# Altium schematic sheet Test Points.SchDoc
size A3; SheetNumber: 11; SheetTotal: 15
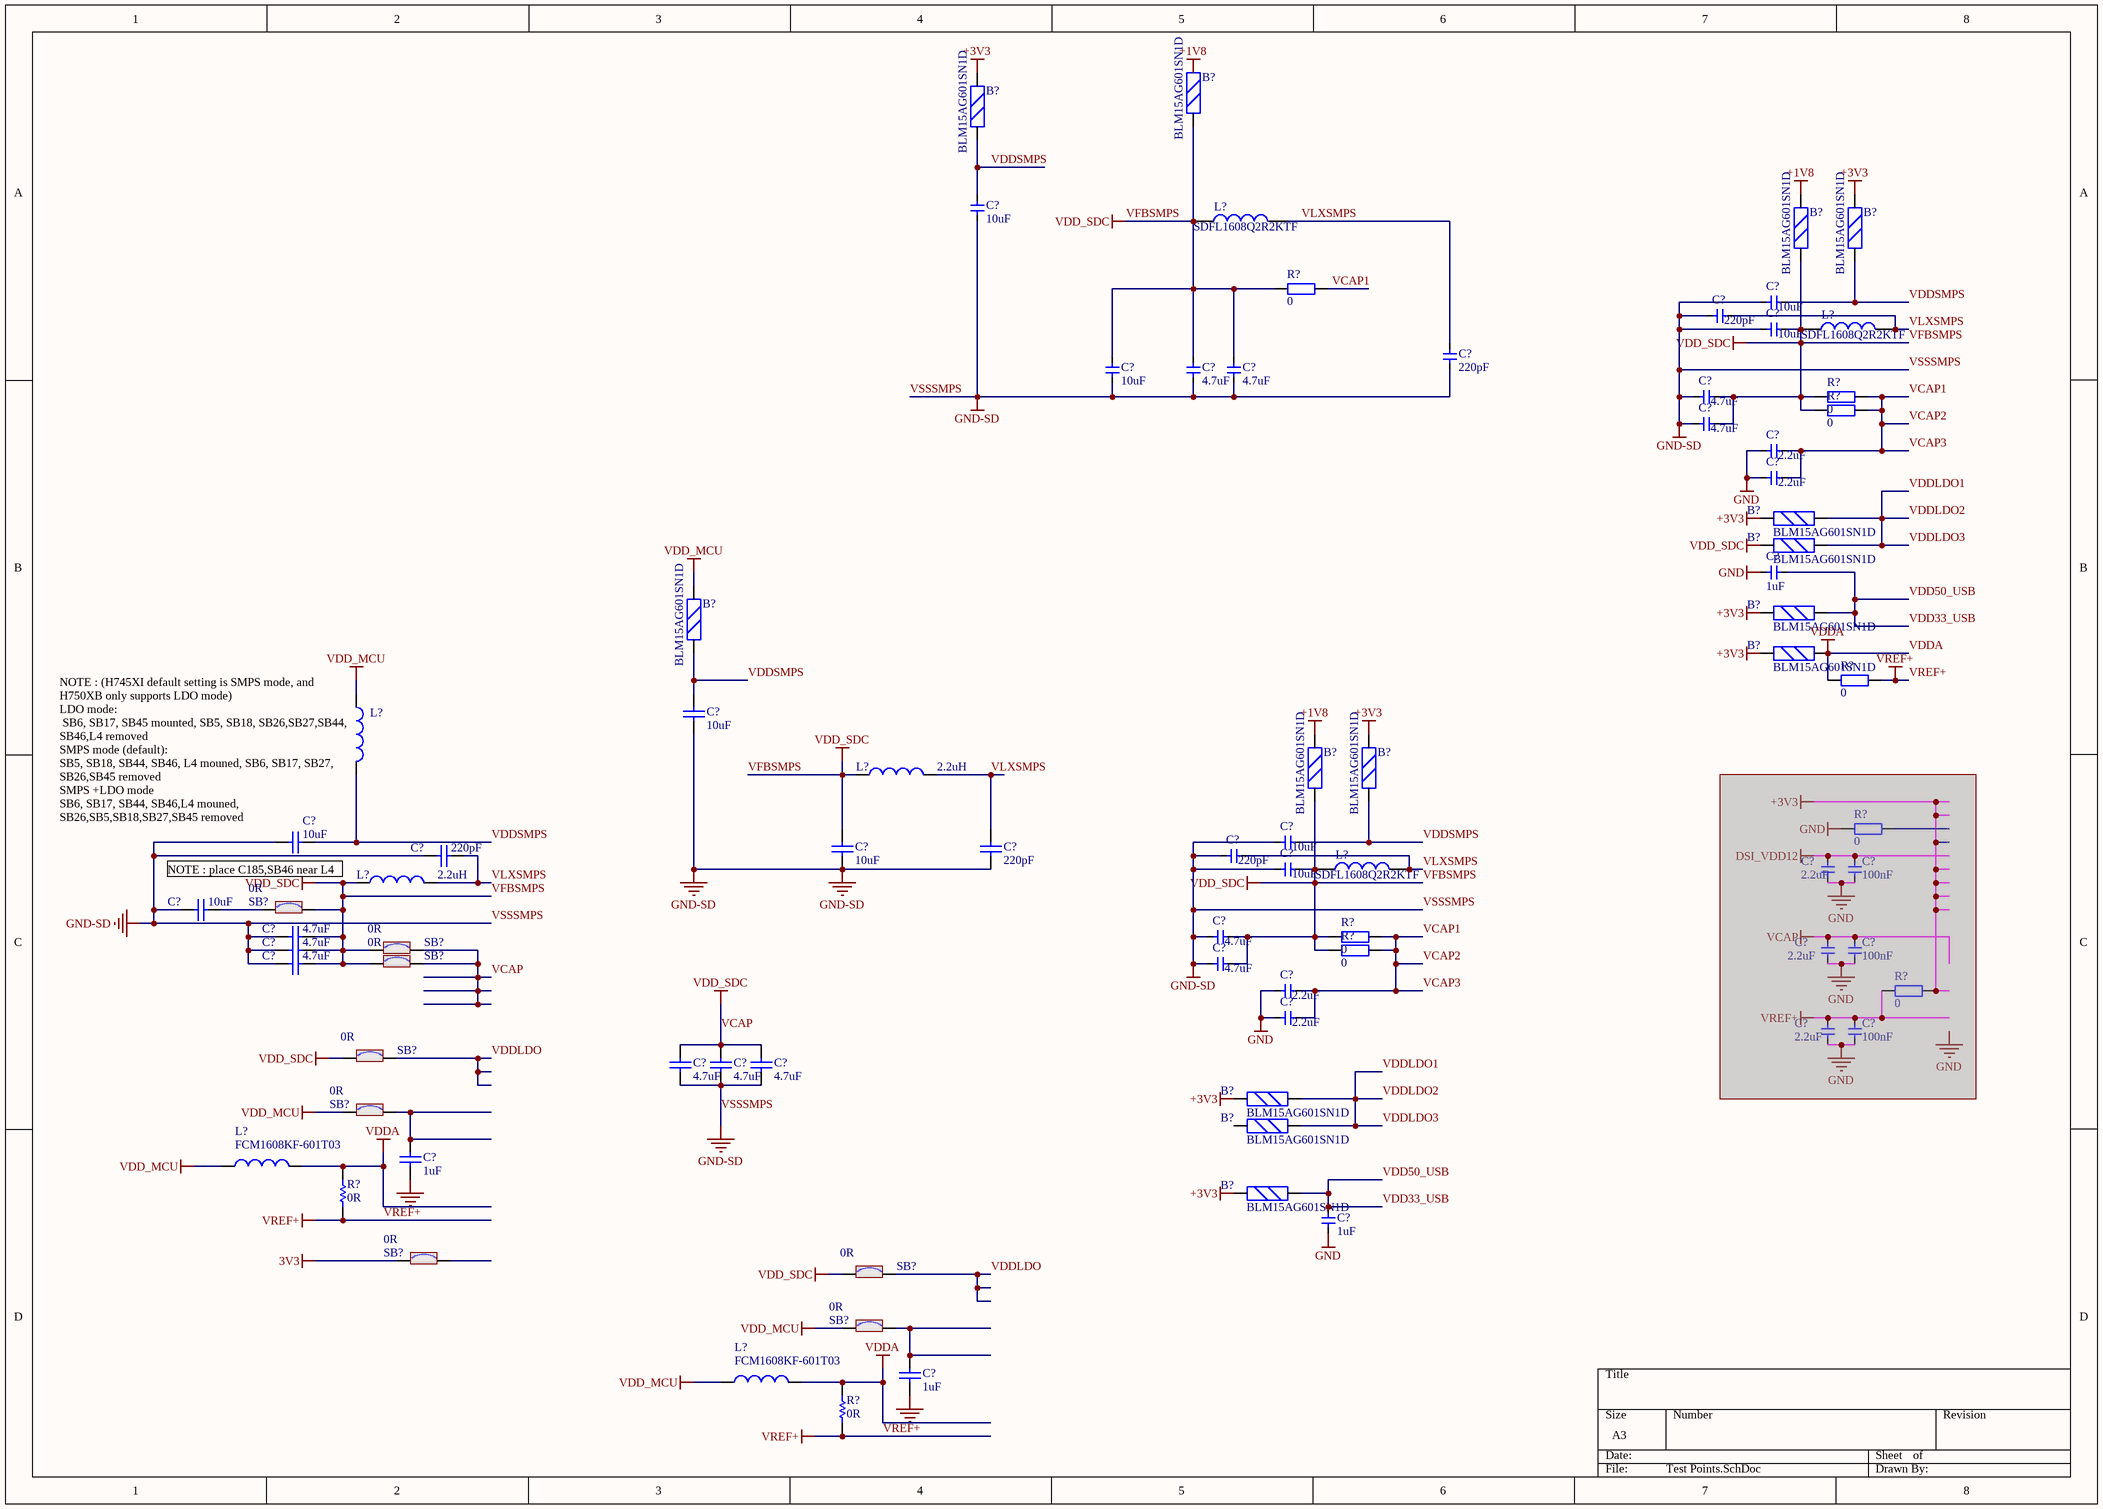
[diagram p0: Test Points.SchDoc]

## Parts
(Parts that share a designator on the sheet are numbered #1, #2 ... from top to bottom, then left to right.)
B?#1  BLM15AG601SN1D  [L0603]
B?#2  BLM15AG601SN1D  [L0603]
B?#3  BLM15AG601SN1D  [L0603]
B?#4  BLM15AG601SN1D  [L0603]
B?#5  BLM15AG601SN1D  [L0603]
B?#6  BLM15AG601SN1D  [L0603]
B?#7  BLM15AG601SN1D  [L0603]
B?#8  BLM15AG601SN1D  [L0603]
B?#9  BLM15AG601SN1D  [L0603]
B?#10  BLM15AG601SN1D  [L0603]
B?#11  BLM15AG601SN1D  [L0603]
B?#12  BLM15AG601SN1D  [L0603]
B?#13  BLM15AG601SN1D  [L0603]
B?#14  BLM15AG601SN1D  [L0603]
C?#1  10uF  [0402_CAP]
C?#2  10uF  [0402_CAP]
C?#3  220pF  [0402_CAP]
C?#4  10uF  [0402_CAP]
C?#5  220pF  [0402_CAP]
C?#6  10uF  [0402_CAP]
C?#7  4.7uF  [0402_CAP]
C?#8  4.7uF  [0402_CAP]
C?#9  4.7uF  [0402_CAP]
C?#10  4.7uF  [0402_CAP]
C?#11  2.2uF  [0402_CAP]
C?#12  2.2uF  [0402_CAP]
C?#13  1uF  [0402_CAP]
C?#14  value 10uF  [C0402]  (hidden comment: Capacitor)
C?#15  value 10uF  [C0402]  (hidden comment: Capacitor)
C?#16  value 220pF  [C0402]  (hidden comment: Capacitor)
C?#17  10uF  [0402_CAP]
C?#18  value 10uF  [C0603]  (hidden comment: Capacitor)
C?#19  value 220pF  [C0402]  (hidden comment: Capacitor)
C?#20  220pF  [0402_CAP]
C?#21  10uF  [0402_CAP]
C?#22  2.2uF  [0402_CAP]  (masked out: inside a compile mask, not in the netlist)
C?#23  100nF  [0402_CAP]  (masked out: inside a compile mask, not in the netlist)
C?#24  value 10uF  [C0603]  (hidden comment: Capacitor)
C?#25  4.7uF  [0402_CAP]
C?#26  value 4.7uF  [C0402]  (hidden comment: Capacitor)
C?#27  2.2uF  [0402_CAP]  (masked out: inside a compile mask, not in the netlist)
C?#28  100nF  [0402_CAP]  (masked out: inside a compile mask, not in the netlist)
C?#29  value 4.7uF  [C0402]  (hidden comment: Capacitor)
C?#30  4.7uF  [0402_CAP]
C?#31  value 4.7uF  [C0402]  (hidden comment: Capacitor)
C?#32  2.2uF  [0402_CAP]
C?#33  2.2uF  [0402_CAP]
C?#34  2.2uF  [0402_CAP]  (masked out: inside a compile mask, not in the netlist)
C?#35  100nF  [0402_CAP]  (masked out: inside a compile mask, not in the netlist)
C?#36  value 4.7uF  [C0402]  (hidden comment: Capacitor)
C?#37  value 4.7uF  [C0402]  (hidden comment: Capacitor)
C?#38  value 4.7uF  [C0402]  (hidden comment: Capacitor)
C?#39  value 1uF  [C0603]  (hidden comment: Capacitor)
C?#40  1uF  [0402_CAP]
C?#41  value 1uF  [C0603]  (hidden comment: Capacitor)
L?#1  SDFL1608Q2R2KTF  [L0805]
L?#2  SDFL1608Q2R2KTF  [L0805]
L?#3  Inductor  [IND_TAIYO-YUDEN_FBMJ1608]  (value not drawn)
L?#4  value 2.2uH  [IND_2016_MURATA_LQM2MPN2R2NG0]
L?#5  value 2.2uH  [IND_2016_MURATA_LQM2MPN2R2NG0]
L?#6  SDFL1608Q2R2KTF  [L0805]
L?#7  Manufacturer_Part_Number: FCM1608KF-601T03  [L0603]  (hidden comment: BEAD)
L?#8  Manufacturer_Part_Number: FCM1608KF-601T03  [L0603]  (hidden comment: BEAD)
R?#1  0  [0402_RES]
R?#2  0  [0402_RES]
R?#3  0  [0402_RES]
R?#4  0  [0402_RES]
R?#5  0  [0402_RES]  (masked out: inside a compile mask, not in the netlist)
R?#6  0  [0402_RES]
R?#7  0  [0402_RES]
R?#8  0  [0402_RES]  (masked out: inside a compile mask, not in the netlist)
R?#9  value 0R  [R0603]  (hidden comment: Resistor)
R?#10  value 0R  [R0603]  (hidden comment: Resistor)
SB?#1  value 0R  [SOLDER-BRIDGE_R0603-0R]  (hidden comment: SB_ON)
SB?#2  value 0R  [SOLDER-BRIDGE_R0603-0R]  (hidden comment: SB_ON)
SB?#3  value 0R  [SOLDER-BRIDGE_R0603-0R]  (hidden comment: SB_ON)
SB?#4  value 0R  [SOLDER-BRIDGE_R0603-0R]  (hidden comment: SB_ON)
SB?#5  value 0R  [SOLDER-BRIDGE_R0603-0R]  (hidden comment: SB_ON)
SB?#6  value 0R  [SOLDER-BRIDGE_R0603-0R]  (hidden comment: SB_ON)
SB?#7  value 0R  [SOLDER-BRIDGE_R0603-0R]  (hidden comment: SB_ON)
SB?#8  value 0R  [SOLDER-BRIDGE_R0603-0R]  (hidden comment: SB_ON)

## Nets
3V3: SB?#6.1
+1V8: B?#3.2 B?#10.2
+3V3: B?#2.2 B?#4.2 B?#5.1 B?#7.1 B?#9.1 B?#11.2 B?#12.1 B?#14.1
GND: C?#11.1 C?#12.1 C?#13.1 C?#32.1 C?#33.1 C?#39.1 C?#40.1 C?#41.1
VCAP: B?#1.1 B?#3.1 B?#6.1 B?#10.1 C?#4.2 C?#6.2 C?#7.2 C?#8.2 C?#9.2 C?#10.2 C?#18.2 C?#21.2 C?#25.2 C?#26.1 C?#29.1 C?#30.2 C?#31.1 C?#36.1 C?#37.1 C?#38.1 L?#1.1 L?#2.1 L?#4.1 L?#5.1 L?#6.1 R?#1.1 R?#2.1 R?#3.1 R?#6.1 R?#7.1 SB?#1.2 SB?#2.1 SB?#2.2 SB?#3.1 SB?#3.2 SB?#4.1 SB?#7.1  [also labelled VDD_SDC, VFBSMPS]
VDD_MCU: B?#8.2 L?#3.1 L?#7.1 L?#8.1 SB?#5.1 SB?#8.1
VDDA: B?#9.2 L?#7.2 L?#8.2 R?#4.1 R?#9.1 R?#10.1
VREF+: R?#4.2 R?#9.2 R?#10.2
VSSSMPS: C?#1.1 C?#2.1 C?#3.1 C?#4.1 C?#5.1 C?#6.1 C?#7.1 C?#8.1 C?#9.1 C?#10.1 C?#14.1 C?#15.1 C?#16.1 C?#17.1 C?#18.1 C?#19.1 C?#20.1 C?#21.1 C?#24.1 C?#25.1 C?#26.2 C?#29.2 C?#30.1 C?#31.2 C?#36.2 C?#37.2 C?#38.2  [also labelled GND-SD]
VCAP1: C?#11.2 C?#12.2 C?#32.2 C?#33.2 R?#1.2 R?#2.2 R?#3.2 R?#6.2 R?#7.2  [also labelled VCAP2, VCAP3]
VDD33_USB: B?#7.2 B?#14.2 C?#13.2 C?#40.2  [also labelled VDD50_USB]
VDDLDO: SB?#4.2 SB?#7.2
VDDLDO1: B?#5.2 B?#6.2 B?#12.2 B?#13.2  [also labelled VDDLDO2, VDDLDO3]
VDDSMPS: B?#2.1 B?#4.1 B?#8.1 B?#11.1 C?#1.2 C?#2.2 C?#14.2 C?#15.2 C?#17.2 L?#3.2
VLXSMPS: C?#3.2 C?#5.2 C?#16.2 C?#19.2 C?#20.2 L?#1.2 L?#2.2 L?#4.2 L?#5.2 L?#6.2
NetC?#24_2: C?#24.2 SB?#1.1
NetC?#39_2: C?#39.2 SB?#5.2
NetC?#41_2: C?#41.2 SB?#8.2

Not connected (* = marked no-connect by the designer): B?#1 2; B?#13 1; SB?#6 2

## Notes on the sheet
- (near L?#3) NOTE : (H745XI default setting is SMPS mode, and H750XB only supports LDO mode)
  LDO mode:
  SB6, SB17, SB45 mounted, SB5, SB18, SB26,SB27,SB44, SB46,L4 removed
  SMPS mode (default):
  SB5, SB18, SB44, SB46, L4 mouned, SB6, SB17, SB27, SB26,SB45 removed
  SMPS +LDO mode
  SB6, SB17, SB44, SB46,L4 mouned, SB26,SB5,SB18,SB27,SB45 removed
- NOTE : place C185,SB46 near L4
- Labels drawn without touching a wire or pin: +1V8

## Library data of the parts
B?#1-B?#14 = BEAD
C?#1-C?#13 C?#17 C?#20-C?#23 C?#25 C?#27 C?#28 C?#30 C?#32-C?#35 C?#40 = 电容-0402: Capacitor; Value: 0.1u
C?#14 C?#15 = MCD-01355: Capacitor, MLCC, 10uF, 4V, X5R, 20%, 0402, T=0,5mm; Manufacturer_Part_Number: GRM155R60G106ME44; Manufacturer: MURATA; Part_Preference: Recommended; Partial_Alternate_Internal_Part_Number: MCD-01716, MCD-02999; Provided_By: Subcon; Initial_Board_Reference: MB1372; Component_Country_Of_Origin: Japan°°; ID: 3455; Order_Code_RS: 172-6477; ShowFields: YES; Internal_Part_Number: MCD-01355; ComponentLink1Description: Datasheet; Status: Released; Part_Type: Capacitor; Package: 0402; ComponentLink1URL: http://tunmcdsvn.tun.st.com/Component_Documentation_Library/Trunk/Capacitor/MURATA_GRM_Series; Order_Code_Digikey: 490-10693-1-ND; Order_Code_Farnell: 2611904
C?#16 C?#19 = MCD-01225: Capacitor, MLCC, 220pF, 50V, NPO, 5%, 0402, T=0,5mm; Manufacturer_Part_Number: CC0402JRNPO9BN221; Manufacturer: YAGEO; Part_Preference: Recommended; Provided_By: Subcon; Initial_Board_Reference: MB1331; Component_Country_Of_Origin: China; ID: 3272; Order_Code_RS: 616-9284; ShowFields: YES; Internal_Part_Number: MCD-01225; Status: Released; Part_Type: Capacitor; Package: 0402; ComponentLink1Description: Datasheet; ComponentLink1URL: http://tunmcdsvn.tun.st.com/Component_Documentation_Library/Trunk/Capacitor/YAGEO_NP0_Series; Order_Code_Digikey: 311-1416-1-ND; Order_Code_Farnell: 3019240
C?#18 C?#24 = MCD-01341: Capacitor, MLCC, 10uF, 6V3, X5R, 20%, 0603, T=0,8mm; Manufacturer_Part_Number: GRM188R60J106ME47D; Manufacturer: MURATA; Part_Preference: Recommended; Provided_By: Subcon; Initial_Board_Reference: MB1331; Component_Country_Of_Origin: Japan°°; ID: 3441; ShowFields: YES; Internal_Part_Number: MCD-01341; ComponentLink1Description: Datasheet; Status: Released; Part_Type: Capacitor; Package: 0603; ComponentLink1URL: http://tunmcdsvn.tun.st.com/Component_Documentation_Library/Trunk/Capacitor/MURATA_GRM_Series; Order_Code_Digikey: 490-3896-1-ND; Order_Code_Farnell: 1735528; Order_Code_RS: N/A
C?#26 C?#29 C?#31 C?#36-C?#38 = MCD-01356: Capacitor, MLCC, 4.7uF, 6V3, X5R, 20%, 0402, T=0,5mm; Manufacturer_Part_Number: GRM155R60J475ME47; Manufacturer: MURATA; Part_Preference: Recommended; Provided_By: Subcon; Initial_Board_Reference: MB1372; Component_Country_Of_Origin: Japan°°; ID: 3456; Order_Code_RS: 814-5230; ShowFields: YES; Internal_Part_Number: MCD-01356; ComponentLink1Description: Datasheet; Status: Released; Part_Type: Capacitor; Package: 0402; ComponentLink1URL: http://tunmcdsvn.tun.st.com/Component_Documentation_Library/Trunk/Capacitor/MURATA_GRM_Series; Order_Code_Digikey: 490-5915-1-ND; Order_Code_Farnell: 2666407
C?#39 C?#41 = MCD-00010: Capacitor, MLCC, 1uF, 16V, X5R, 10%, 0603, T=0,8mm; Manufacturer_Part_Number: CC0603KRX5R7BB105; Manufacturer: YAGEO; Part_Preference: Recommended; Provided_By: Subcon; Initial_Board_Reference: mb1274; Component_Country_Of_Origin: China; ID: 2470; Order_Code_RS: 2370680; ShowFields: YES; Internal_Part_Number: MCD-00010; Status: Released; Part_Type: Capacitor; Package: 0603; ComponentLink1Description: Yageo_Capacitor_X5R-series.pdf; ComponentLink1URL: http://tunmcdsvn.tun.st.com/Component_Documentation_Library/Trunk/Capacitor/YAGEO_X5R_Series; ECCN_US: n/a; ECCN_EU: n/a; Order_Code_Digikey: 311-1444-1-ND; Order_Code_Farnell: 2370680
L?#1 L?#2 L?#6 = L: 贴片小功率电感; BOM名称: 小功率贴片电感; 联系下单店铺卖家 免费帮你查找封装: 联系下单店铺卖家 免费技术支持
L?#3 = MCD-01431: Ferrite bead, 18R @ 100MHz, +/-30%, 750mA, 0R004, 0603, T=1mm; Manufacturer_Part_Number: FBMJ1608HM180NTR; Manufacturer: TAIYO YUDEN; Part_Preference: Forbidden; ShowFields: YES; ID: 3531; Component_Country_Of_Origin: Unknown; Internal_Part_Number: MCD-01431; Value: 18R @ 100MHz; Status: Obsolete; Part_Type: Inductor; Package: 0603; ComponentLink1URL: http://tunmcdsvn.tun.st.com/Component_Documentation_Library/Trunk/Inductor/TAIYO_YUDEN_FB-M_Series; Order_Code_Digikey: 587-3251-1-ND; Order_Code_Farnell: 2860452; Order_Code_RS: N/A
L?#4 L?#5 = MCD-01110: Inductor 2.2uH, 2x1.6x0.9mm; Manufacturer_Part_Number: LQM2MPN2R2NG0; Manufacturer: MURATA; Part_Preference: Recommended; Provided_By: Subcon; Initial_Board_Reference: MB1381; Component_Country_Of_Origin: Japan°°; ID: 3384; ShowFields: YES; Internal_Part_Number: MCD-01110; Status: Checked; Part_Type: Inductor; ComponentLink1Description: Murata_inductor_LQM2MPN.pdf; ComponentLink1URL: http://tunmcdsvn.tun.st.com/Component_Documentation_Library/Trunk/Inductor/MURATA_LQM_Series; ECCN_US: n/a; ECCN_EU: n/a; Order_Code_Digikey: 490-7786-1-ND; Order_Code_Farnell: 2470314; Order_Code_RS: N/A; Package: 0806
L?#7 L?#8 = MCD-00047: Ferrite bead, 600R @1 00MHz, +/-25%, 350mA, 0R5, 0603, T=0.8mm; Part_Type: Inductor; Manufacturer: TAI-TECH; Part_Preference: Recommended; Partial_Alternate_Internal_Part_Number: MCD-02959; Component_Country_Of_Origin: Unknown; ID: 2546; ShowFields: YES; Internal_Part_Number: MCD-00047; Value: 600R @ 100MHz; Status: Released; ComponentLink1URL: http://tunmcdsvn.tun.st.com/Component_Documentation_Library/Trunk/Inductor/TAI-TECH_FCM-1608_Series; Order_Code_Digikey: N/A; Order_Code_Farnell: N/A; Order_Code_RS: N/A; Package: 0603
R?#1-R?#8 = R: 贴片电阻; 联系卖家，免费查找封装: 唯一出售店铺网址https://shop463601444.taobao.com; BOM名称: 贴片电阻
R?#9 R?#10 = MCD-00181: Resistor,0R,0603,ULO; Manufacturer_Part_Number: PMR03EZPJ000; Manufacturer: ROHM SEMICONDUCTOR; Part_Preference: Recommended; Provided_By: Subcon; Component_Country_Of_Origin: Philippines, Thailand°°; ID: 2691; ShowFields: YES; Internal_Part_Number: MCD-00181; Status: Released; Part_Type: Resistor; Package: 0603; ComponentLink1Description: ROHM_ULtra low Ohmic Resistor _PMR10EZPJ000.pdf; ComponentLink1URL: http://tunmcdsvn.tun.st.com/Component_Documentation_Library/Trunk/Resistor/ROHM_PMR_Series; ECCN_US: n/a; ECCN_EU: n/a; Order_Code_Digikey: PMR03EZPJ000-ND; Order_Code_Farnell: N/A; Order_Code_RS: N/A
SB?#1-SB?#8 = MCD-00071: Solder Bridge ON; Part_Type: Resistor; Manufacturer: YAGEO; Manufacturer_HQ_COO: Unknown; Manufacturer_Part_Number: RC0603JR-070RL; Part_Preference: Recommended; Provided_By: Subcon; Initial_Board_Reference: mb1274; Component_Country_Of_Origin: China; ID: 2521; Order_Code_RS: 199-5647; ShowFields: YES; Internal_Part_Number: MCD-00071; ECCN_US: n/a; ECCN_EU: n/a; Status: Released; ComponentLink1URL: http://tunmcdsvn.tun.st.com/Component_Documentation_Library/Trunk/Resistor/YAGEO_RC_Series; Order_Code_Digikey: 311-0.0GRTR-ND; Order_Code_Farnell: 2421846; Package: 0603